# EAGLE design LCmeter0-LCD-8pinlcd-alt2 (EAGLE 7.2.0)
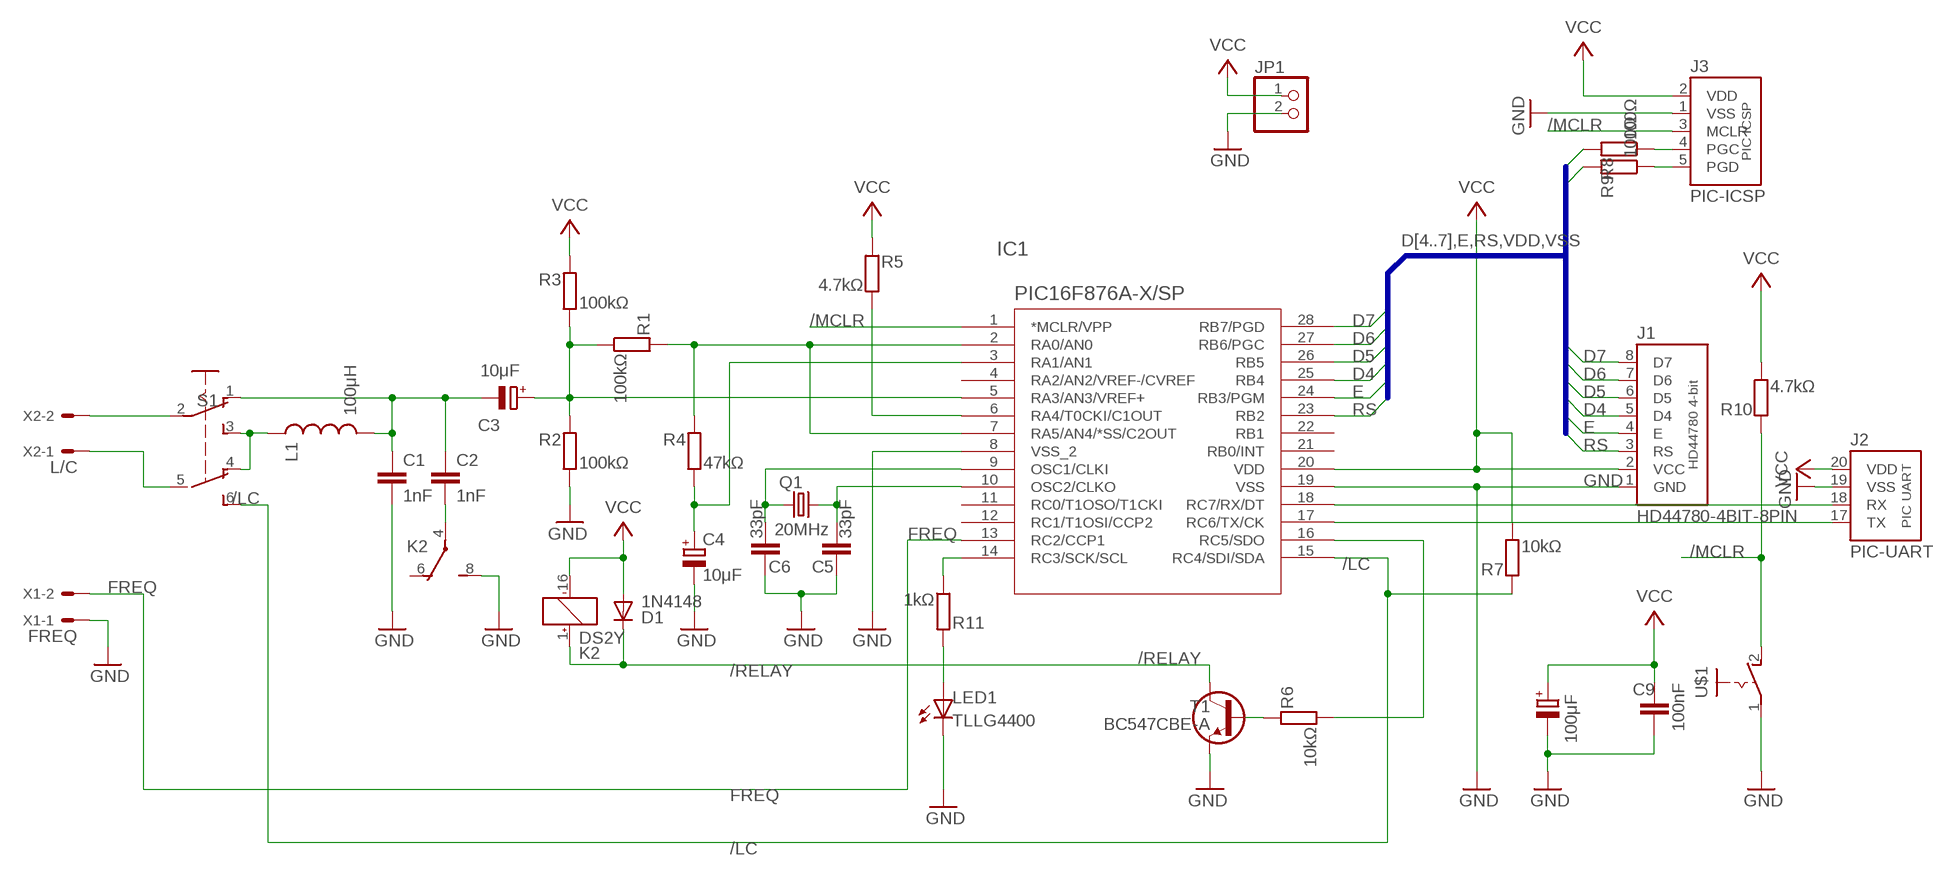
[diagram p0: schematic, sheet 1]

## Parts
C1  1nF  C050-020X036  [C050-020X036]
C2  1nF  C050-020X036  [C050-020X036]
C3  10μF  CPOLE2,5-4  [E2,5-4]
C4  10μF  CPOLE2,5-4  [E2,5-4]
C5  33pF  C025-020X036  [C025-020X036]
C6  33pF  C025-020X036  [C025-020X036]
C7  100μF  CPOLE2.5-6  [E2,5-6]
C9  100nF  C-EU025-024X044  [C025-024X044]
D1  1N4148  1N414834-7  [DO34-7]
IC1  PIC16F876A-X/SP  [DIL28-3]
J1  HD44780-4BIT-8PIN  [CONN-8P]
J2  PIC-UART  [PIC-UART]
J3  PIC-ICSP  [CONN-5P]
JP1  PINHD-1X2  [1X02]
K2  DS2Y  DS2Y-S-DC5V  [DS2Y]
L1  100μH  L-09R  [L-8R]
LED1  TLLG4400  [LED3MM]
Q1  20MHz  CRYSTALHC49  [HC49]
R1  100kΩ  R0202/7  [0202/7]
R2  100kΩ  R0202/7  [0202/7]
R3  100kΩ  R0202/7  [0202/7]
R4  47kΩ  R0202/7  [0202/7]
R5  4.7kΩ  R0202/7  [0202/7]
R6  10kΩ  R0202/7  [0202/7]
R7  10kΩ  R0202/10  [0202/10]
R8  100Ω  R0202/5  [0202/5]
R9  100Ω  R0202/5  [0202/5]
R10  4.7kΩ  R0202/7  [0202/7]
R11  1kΩ  R0202/5  [0202/5]
S1  SL-SW-2P-2T  [SLSW-2P2T]
T1  BC547CBE-A  [TO92-CBE-A]
U$1  PB-1P-1T  [PB-1P1T]
X1  FREQ  C-GRID-02-70543  [70543-02]
X2  L/C  C-GRID-02-70543  [70543-02]

## Nets
/LC: IC1.15(RC4/SDI/SDA) R7.2 S1.6(S1)
/MCLR: IC1.1(*MCLR/VPP) J3.3(MCLR) R10.2 U$1.2(S)
/RELAY: D1.C K2.1(1:+) T1.C
A0: IC1.2(RA0/AN0) IC1.7(RA5/AN4/*SS/C2OUT) R1.2 R4.2
A1: C4.+ IC1.3(RA1/AN1) R4.1
A3: C3.+ IC1.5(RA3/AN3/VREF+) R1.1 R2.2 R3.1
A4: IC1.6(RA4/T0CKI/C1OUT) R5.1
C2_CON: C2.2 K2.4(2:P)
D4: IC1.25(RB4) J1.5(D4)
D5: IC1.26(RB5) J1.6(D5)
D6: IC1.27(RB6/PGC) J1.7(D6) R9.2
D7: IC1.28(RB7/PGD) J1.8(D7) R8.2
E: IC1.24(RB3/PGM) J1.4(E)
FREQ: IC1.13(RC2/CCP1) X1.2
GND: C1.2 C4.- C5.1 C6.1 C7.- C9.2 IC1.8(VSS_2) IC1.19(VSS) J1.1(GND) J2.19(VSS) J3.1(VSS) JP1.2 K2.8(2:S) LED1.K(C) R2.1 T1.E U$1.1(P) X1.1
M+: S1.2(P) X2.2
M-: S1.5(P1) X2.1
N$1: J3.4(PGC) R8.1
N$2: C1.1 C2.1 C3.- L1.P$2 S1.1(O)
N$3: J3.5(PGD) R9.1
N$4: IC1.14(RC3/SCK/SCL) R11.1
N$5: R6.2 T1.B
N$6: LED1.A R11.2
N$7: L1.P$1 S1.3(S) S1.4(O1)
N$8: IC1.17(RC6/TX/CK) J2.17(TX)
OSC1: C6.2 IC1.9(OSC1/CLKI) Q1.1
OSC2: C5.2 IC1.10(OSC2/CLKO) Q1.2
RC5: IC1.16(RC5/SDO) R6.1
RS: IC1.23(RB2) J1.3(RS)
RX: IC1.18(RC7/RX/DT) J2.18(RX)
VCC: C7.+ C9.1 D1.A IC1.20(VDD) J1.2(VCC) J2.20(VDD) J3.2(VDD) JP1.1 K2.16(1:-) R3.2 R5.2 R7.1 R10.1
Unconnected: IC1.4(RA2/AN2/VREF-/CVREF) IC1.11(RC0/T1OSO/T1CKI) IC1.12(RC1/T1OSI/CCP2) IC1.21(RB0/INT) IC1.22(RB1) K2.6(2:O) K2.9(3:S) K2.11(3:O) K2.13(3:P)

## Buses
D[4..7],E,RS,VDD,VSS

## Library data of the parts
C1 C2 C5 C6 = c:C: CAPACITOR, European symbol
C3 C4 C7 = c:CPOL: POLARIZED CAPACITOR, European symbol
C9 = rcl:C-EU: CAPACITOR, European symbol
D1 = d:1N4148
IC1 = mcu:PIC16F876A-X/SP
J1 = pinconn:HD44780-4BIT
J2 = pinconn:PIC-UART
J3 = pinconn:PIC-ICSP
JP1 = pinhead:PINHD-1X2: PIN HEADER
K2 = relay:DS2Y-S-DC*: MINIATURE RELAY NAiS Source: http://www.mew-europe.com/.. en_ds_61005_0023.pdf; MPN: DS2Y-S-DC5V; OC_FARNELL: unknown; OC_NEWARK: 13P3268
L1 = r:L
LED1 = led:TLLG4400: Low Current (2mA) LED 3 mm Tinted Diffused Package color GREEN Source: Data sheet <http://www.farnell.com/datasheets/391098.pdf>; MF: VISHAY SEMICONDUCTOR; OC_FARNELL: 1612435
Q1 = q:CRYSTAL
R1-R11 = r:R: RESISTOR, European symbol
S1 = sw:SL-SW-2P-2T
T1 = t:BC547
U$1 = sw:PB-1P-1T
X1 X2 = con-molex:C-GRID-02: CONNECTOR wire to board 2.54 mm (0.100") pitch header; OC_FARNELL: unknown; OC_NEWARK: unknown

## Board
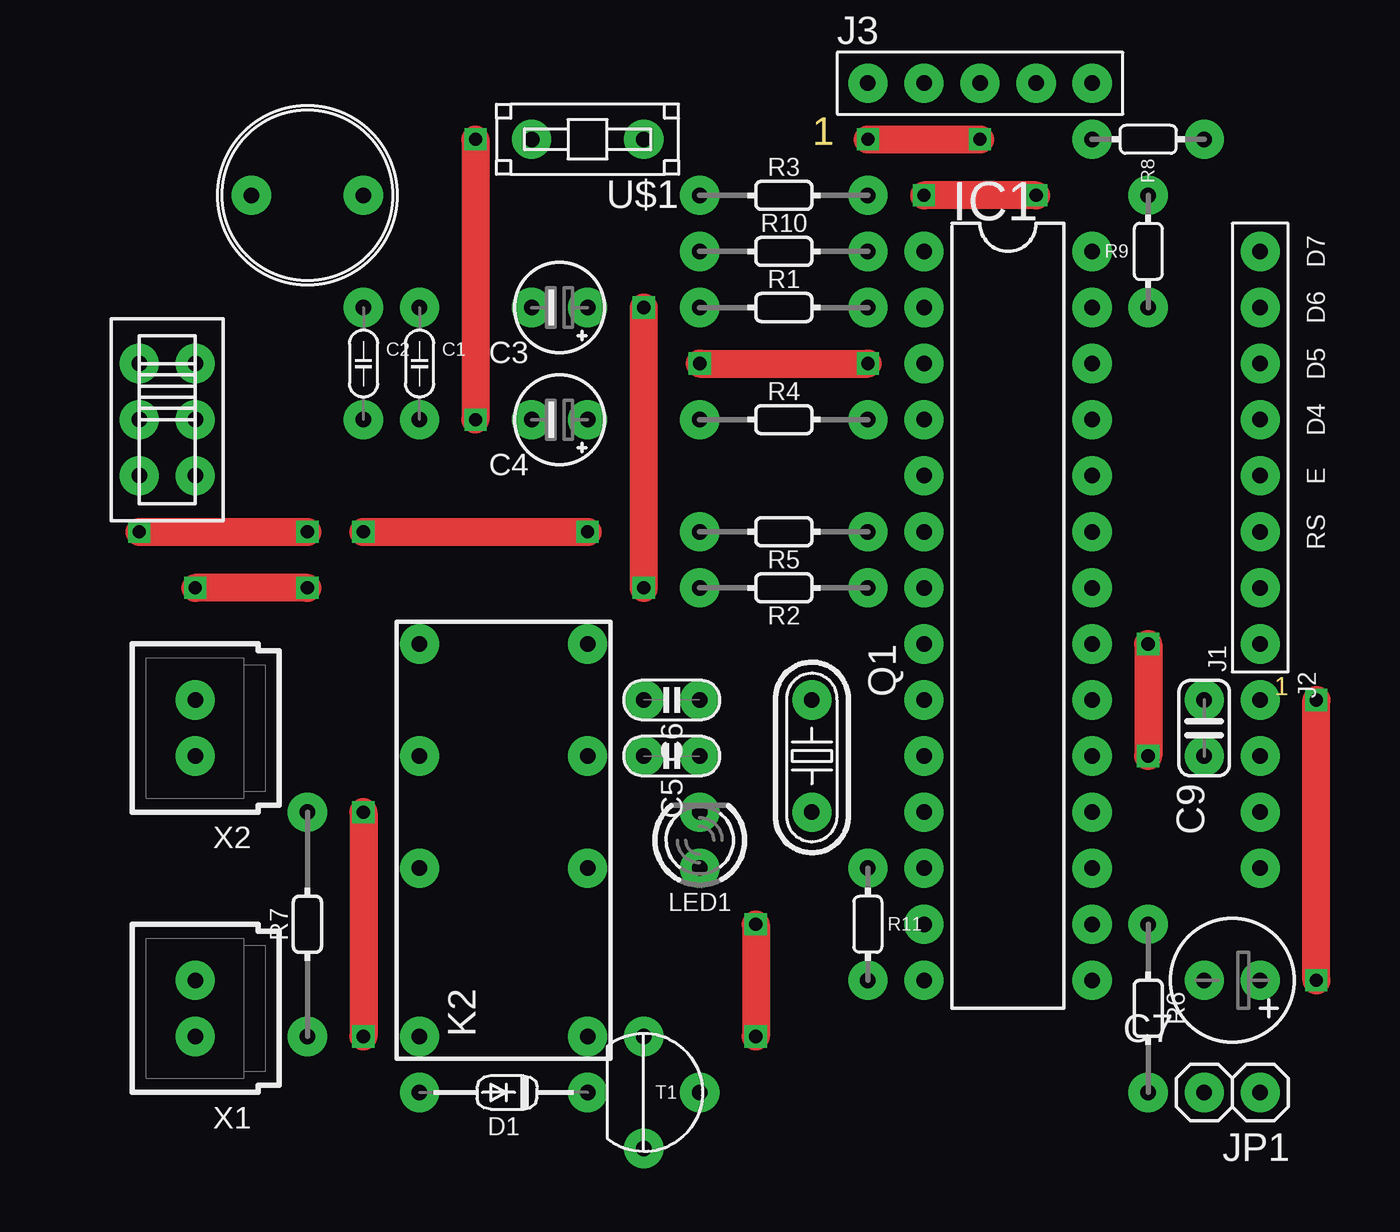
[diagram p1: board, top side]
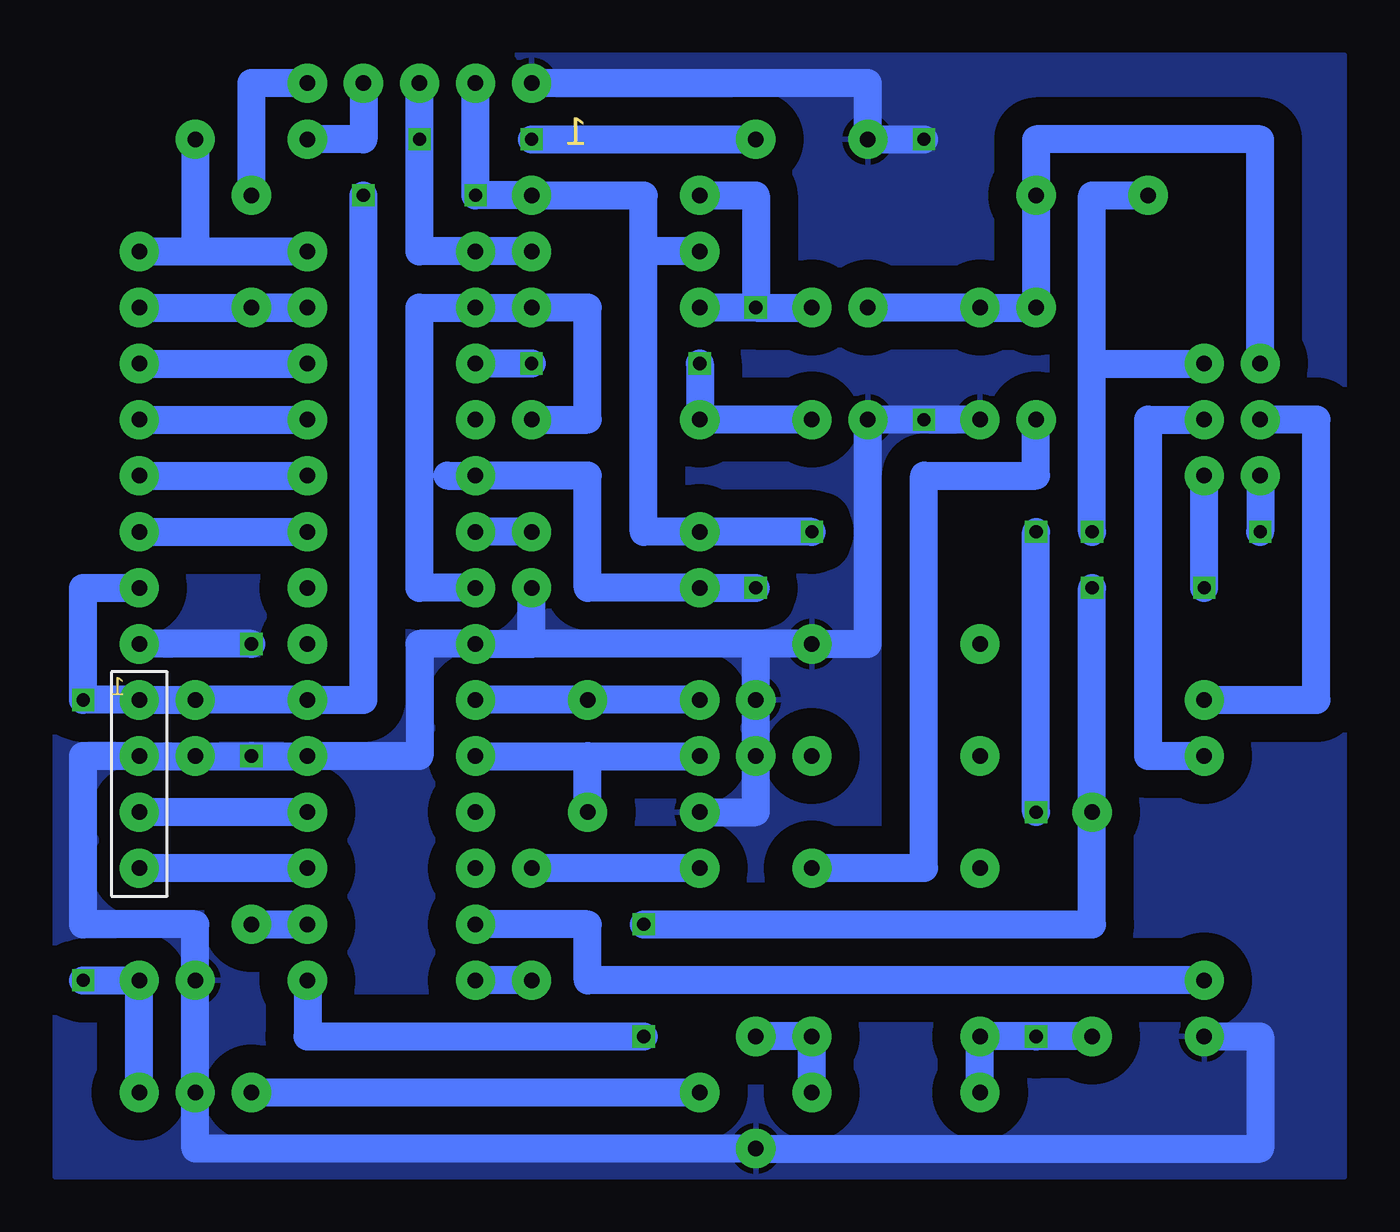
[diagram p2: board, bottom side, seen from below]

No outline drawn. Coordinates in mm, seen from the top.
Copper layers (1*16): Top 0.035mm / dielectric 1.5mm / Bottom 0.035mm
Design rules "default": minimum track width 10mil, minimum drill 24mil, track to track 8mil, track to pad 8mil, pad to pad 8mil, via to via 8mil, smd to smd 8mil, copper to edge 40mil, drill to drill 8mil, minimum pad ring 10mil, minimum via ring 8mil, stop-mask expansion 4mil, vias tented up to drill 0mil, thermal gap 10mil

### Footprints (pad centres in the part's own frame; a part is rotated, then mirrored left to right if it is on the bottom)
C050-020X036 = drill 0.7 pad 1.778: 1 0,2.54; 2 0,-2.54
E2,5-4 = drill 0.7 pad 1.778: + 1.27,0; - -1.27,0
C025-020X036 = drill 0.7 pad 1.778: 1 0,1.27; 2 0,-1.27
E2,5-6 = drill 0.7 pad 1.778: + -1.27,0; - 1.27,0
C025-024X044 = drill 0.7 pad 1.778: 1 -1.27,0; 2 1.27,0
DO34-7 = drill 0.7 pad 1.778: A 3.81,0; C -3.81,0
DIL28-3 = drill 0.7 pad 1.778: 1 -16.51,-3.81; 2 -13.97,-3.81; 3 -11.43,-3.81; 4 -8.89,-3.81; 5 -6.35,-3.81; 6 -3.81,-3.81; 7 -1.27,-3.81; 8 1.27,-3.81; 9 3.81,-3.81; 10 6.35,-3.81; 11 8.89,-3.81; 12 11.43,-3.81; 13 13.97,-3.81; 14 16.51,-3.81; 15 16.51,3.81; 16 13.97,3.81; 17 11.43,3.81; 18 8.89,3.81; 19 6.35,3.81; 20 3.81,3.81; 21 1.27,3.81; 22 -1.27,3.81; 23 -3.81,3.81; 24 -6.35,3.81; 25 -8.89,3.81; 26 -11.43,3.81; 27 -13.97,3.81; 28 -16.51,3.81
CONN-8P = drill 0.7 pad 1.778: 1 0,0; 2 2.54,0; 3 5.08,0; 4 7.62,0; 5 10.16,0; 6 12.7,0; 7 15.24,0; 8 17.78,0
PIC-UART = drill 0.7 pad 1.778: 17 1.27,1.27; 18 3.81,1.27; 19 6.35,1.27; 20 8.89,1.27
CONN-5P = drill 0.7 pad 1.778: 1 0,0; 2 2.54,0; 3 5.08,0; 4 7.62,0; 5 10.16,0
1X02 = drill 0.7 pad 1.778: 1 -1.27,0; 2 1.27,0
DS2Y = drill 0.7 pad 1.778: 1 -8.89,-3.81; 4 -1.27,-3.81; 6 3.81,-3.81; 8 8.89,-3.81; 9 8.89,3.81; 11 3.81,3.81; 13 -1.27,3.81; 16 -8.89,3.81
L-8R = drill 0.7 pad 1.778: P$1 -2.54,0; P$2 2.54,0
LED3MM = drill 0.7 pad 1.778: A -1.27,0; K 1.27,0
HC49 = drill 0.7 pad 1.778: 1 -2.54,0; 2 2.54,0
0202/7 = drill 0.7 pad 1.778: 1 0,-3.81; 2 0,3.81
0202/10 = drill 0.7 pad 1.778: 1 0,-5.08; 2 0,5.08
0202/5 = drill 0.7 pad 1.778: 1 0,-2.54; 2 0,2.54
SLSW-2P2T = drill 0.7 pad 1.778: 1 -1.27,2.54; 2 -1.27,0; 3 -1.27,-2.54; 4 1.27,2.54; 5 1.27,0; 6 1.27,-2.54
TO92-CBE-A = drill 0.7 pad 1.778: B 2.54,0; C 0,2.54; E 0,-2.54
PB-1P1T = drill 0.7 pad 1.778: 1 2.54,0; 2 -2.54,0
70543-02 = drill 0.7 pad 1.778: 1 -1.27,0; 2 1.27,0

### Placement (x,y rotation side)
C1  15.24,35.56 0 top
C2  12.7,35.56 0 top
C3  21.59,38.1 0 top
C4  21.59,33.02 0 top
C5  26.67,17.78 90 top
C6  26.67,20.32 90 top
C7  52.07,7.62 180 top
C9  50.8,19.05 270 top
D1  19.05,2.54 180 top
IC1  41.91,24.13 270 top
J1  53.34,22.86 90 top
J2  54.61,11.43 90 top
J3  35.56,48.26 0 top
JP1  52.07,2.54 180 top
K2  19.05,13.97 90 top
L1  10.16,43.18 0 top
LED1  27.94,13.97 90 top
Q1  33.02,17.78 270 top
R1  31.75,38.1 270 top
R2  31.75,25.4 90 top
R3  31.75,43.18 270 top
R4  31.75,33.02 270 top
R5  31.75,27.94 90 top
R6  48.26,6.35 180 top
R7  10.16,10.16 0 top
R8  48.26,45.72 270 top
R9  48.26,40.64 180 top
R10  31.75,40.64 270 top
R11  35.56,10.16 0 top
S1  3.81,33.02 0 top
T1  25.4,2.54 0 top
U$1  22.86,45.72 180 top
X1  5.08,6.35 90 top
X2  5.08,19.05 90 top

### Tracks (layer width: path | path; a pad name or v marks a point on that pad's centre or on a via)
/LC  (via drill 0.6)
  Top 1.27: v30.48,10.16 v30.48,5.08 | v10.16,25.4 v5.08,25.4
  Bottom 1.27: IC1.15 45.72,5.08 v30.48,5.08 33.02,5.08 | v30.48,10.16 10.16,10.16 R7.2 v10.16,25.4 | v5.08,25.4 S1.6
/MCLR  (via drill 0.6)
  Top 1.27: v35.56,45.72 v40.64,45.72
  Bottom 1.27: J3.3 v40.64,45.72 40.64,40.64 IC1.1 R10.2 | v35.56,45.72 U$1.2
/RELAY
  Bottom 1.27: T1.C K2.1 D1.C
A0
  Bottom 1.27: IC1.7 40.64,25.4 40.64,38.1 IC1.2 R1.2 33.02,38.1 33.02,33.02 R4.2
A1  (via drill 0.6)
  Top 1.27: v27.94,35.56 v35.56,35.56
  Bottom 1.27: v35.56,35.56 IC1.3 | C4.+ R4.1 v27.94,35.56
A3  (via drill 0.6)
  Top 1.27: v25.4,38.1 v25.4,25.4
  Bottom 1.27: 39.37,30.48 IC1.5 33.02,30.48 33.02,25.4 R2.2 v25.4,25.4 | R3.1 25.4,43.18 v25.4,38.1 | v25.4,38.1 R1.1 | v25.4,38.1 C3.+
A4
  Bottom 1.27: R5.1 IC1.6
C2_CON
  Bottom 1.27: K2.4 17.78,12.7 17.78,30.48 12.7,30.48 C2.2
D4
  Bottom 1.27: J1.5 IC1.25
D5
  Bottom 1.27: J1.6 IC1.26
D6
  Bottom 1.27: R9.2 IC1.27 J1.7
D7
  Bottom 1.27: R8.2 50.8,40.64 | J1.8 50.8,40.64 | 50.8,40.64 IC1.28
E
  Bottom 1.27: J1.4 IC1.24
FREQ
  Bottom 1.27: X1.2 33.02,7.62 33.02,10.16 IC1.13
GND  (via drill 0.6)
  Top 1.27: v48.26,22.86 v48.26,17.78 | v17.78,45.72 v17.78,33.02
  Bottom 1.27: 35.56,22.86 IC1.8 40.64,22.86 40.64,17.78 IC1.19 v48.26,17.78 C9.2 J2.19 55.88,17.78 55.88,10.16 50.8,10.16 C7.- JP1.2 50.8,0 T1.E 2.54,0 2.54,5.08 X1.1 | 25.4,22.86 C6.1 C5.1 25.4,15.24 LED1.K | 25.4,22.86 35.56,22.86 | 35.56,22.86 R2.1 | 25.4,22.86 K2.8 20.32,22.86 C4.- v17.78,33.02 C1.2 | v48.26,22.86 J1.1 | J3.1 20.32,48.26 U$1.1 v17.78,45.72
  pour Bottom (isolate 1.27): -1.27,49.53 57.15,49.53 57.15,-1.27 -1.27,-1.27
M+
  Bottom 1.27: X2.2 0,20.32 0,33.02 S1.2
M-
  Bottom 1.27: X2.1 7.62,17.78 7.62,33.02 S1.5
N$1
  Bottom 1.27: J3.4 43.18,45.72 R8.1
N$2
  Bottom 1.27: C3.- C1.1 C2.1 L1.P$2 12.7,45.72 2.54,45.72 S1.1
N$3
  Bottom 1.27: J3.5 48.26,48.26 R9.1
N$4
  Bottom 1.27: R11.1 IC1.14
N$5
  Bottom 1.27: R6.2 T1.B
N$6
  Bottom 1.27: LED1.A R11.2
N$7  (via drill 0.6)
  Top 1.27: v2.54,27.94 v10.16,27.94
  Bottom 1.27: 10.16,35.56 10.16,43.18 L1.P$1 | S1.3 v2.54,27.94 | v10.16,27.94 10.16,35.56 | 10.16,35.56 S1.4
N$8
  Bottom 1.27: IC1.17 J2.17
OSC1
  Bottom 1.27: C6.2 Q1.1 IC1.9
OSC2
  Bottom 1.27: IC1.10 33.02,17.78 | Q1.2 33.02,17.78 | 33.02,17.78 C5.2
RC5  (via drill 0.6)
  Bottom 1.27: R6.1 IC1.16
  other vias: 48.26,10.16
RS
  Bottom 1.27: J1.3 IC1.23
RX
  Bottom 1.27: IC1.18 J2.18
VCC  (via drill 0.6)
  Top 1.27: v55.88,7.62 v55.88,20.32 | v12.7,15.24 v12.7,5.08 | v12.7,27.94 v22.86,27.94 | v43.18,43.18 v38.1,43.18
  Bottom 1.27: D1.A K2.16 v12.7,5.08 R7.1 | J1.2 55.88,25.4 v55.88,20.32 J2.20 C9.1 IC1.20 43.18,20.32 v43.18,43.18 | JP1.1 C7.+ v55.88,7.62 | 30.48,40.64 30.48,27.94 R5.2 v22.86,27.94 | 30.48,40.64 30.48,43.18 R3.2 v38.1,43.18 J3.2 | v12.7,15.24 v12.7,27.94 | R10.1 30.48,40.64
  other vias: 50.8,20.32

### Text on the board
tPlace: D7 | D6 | D5 | D4 | E | RS
Measures: 20 | 19 | 18 | 17 | 16 | 15 | 14 | 13 | 12 | 11 | 10 | 9 | 8 | 7 | 6 | 5 | 4 | 3 | 2 | 1 | 1 | 2 | 3 | 4 | 5 | 6 | 7 | 8 | 9 | 10 | 11 | 12 | 13 | 14 | 15 | 16 | 17 | 18 | 19 | 20 | 21 | 22 | 23